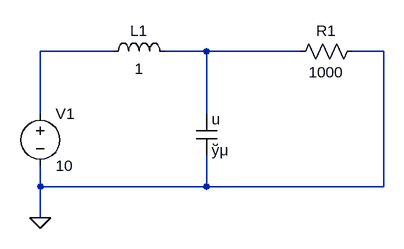
[diagram p0: schematic Draft1.asc]
Draft1.asc, the LTspice schematic file:
Version 4
SHEET 1 880 680
WIRE 224 -16 112 -16
WIRE 368 -16 304 -16
WIRE 512 -16 368 -16
WIRE 640 -16 592 -16
WIRE 112 80 112 -16
WIRE 368 80 368 -16
WIRE 112 192 112 160
WIRE 368 192 368 144
WIRE 368 192 112 192
WIRE 640 192 640 -16
WIRE 640 192 368 192
WIRE 112 240 112 192
FLAG 112 240 0
SYMBOL ind 208 0 R270
WINDOW 0 32 56 VTop 2
WINDOW 3 5 56 VBottom 2
SYMATTR InstName L1
SYMATTR Value 1
SYMATTR SpiceLine Ipk=10 Rser=1 Rpar=1
SYMBOL cap 352 80 R0
SYMATTR InstName u
SYMATTR SpiceLine V=10 Irms=1 Rser=1 Lser=1 Rpar=1 Cpar=1
SYMATTR Value ўμ
SYMBOL res 608 -32 R90
WINDOW 0 0 56 VBottom 2
WINDOW 3 32 56 VTop 2
SYMATTR InstName R1
SYMATTR Value 1000
SYMATTR SpiceLine tol=1 pwr=2.5
SYMBOL voltage 112 64 R0
WINDOW 123 0 0 Left 0
WINDOW 39 24 124 Left 2
SYMATTR InstName V1
SYMATTR Value 10

The netlist it stands for:
* Draft1.asc
L1 N001 N002 1 Ipk=10 Rser=1 Rpar=1
C§u N002 0 ўμ V=10 Irms=1 Rser=1 Lser=1 Rpar=1 Cpar=1
R1 0 N002 1000 tol=1 pwr=2.5
V1 N001 0 10
.backanno
.end